# Altium schematic sheet projet_pcb_naked_g431.SchDoc
size A3 portrait
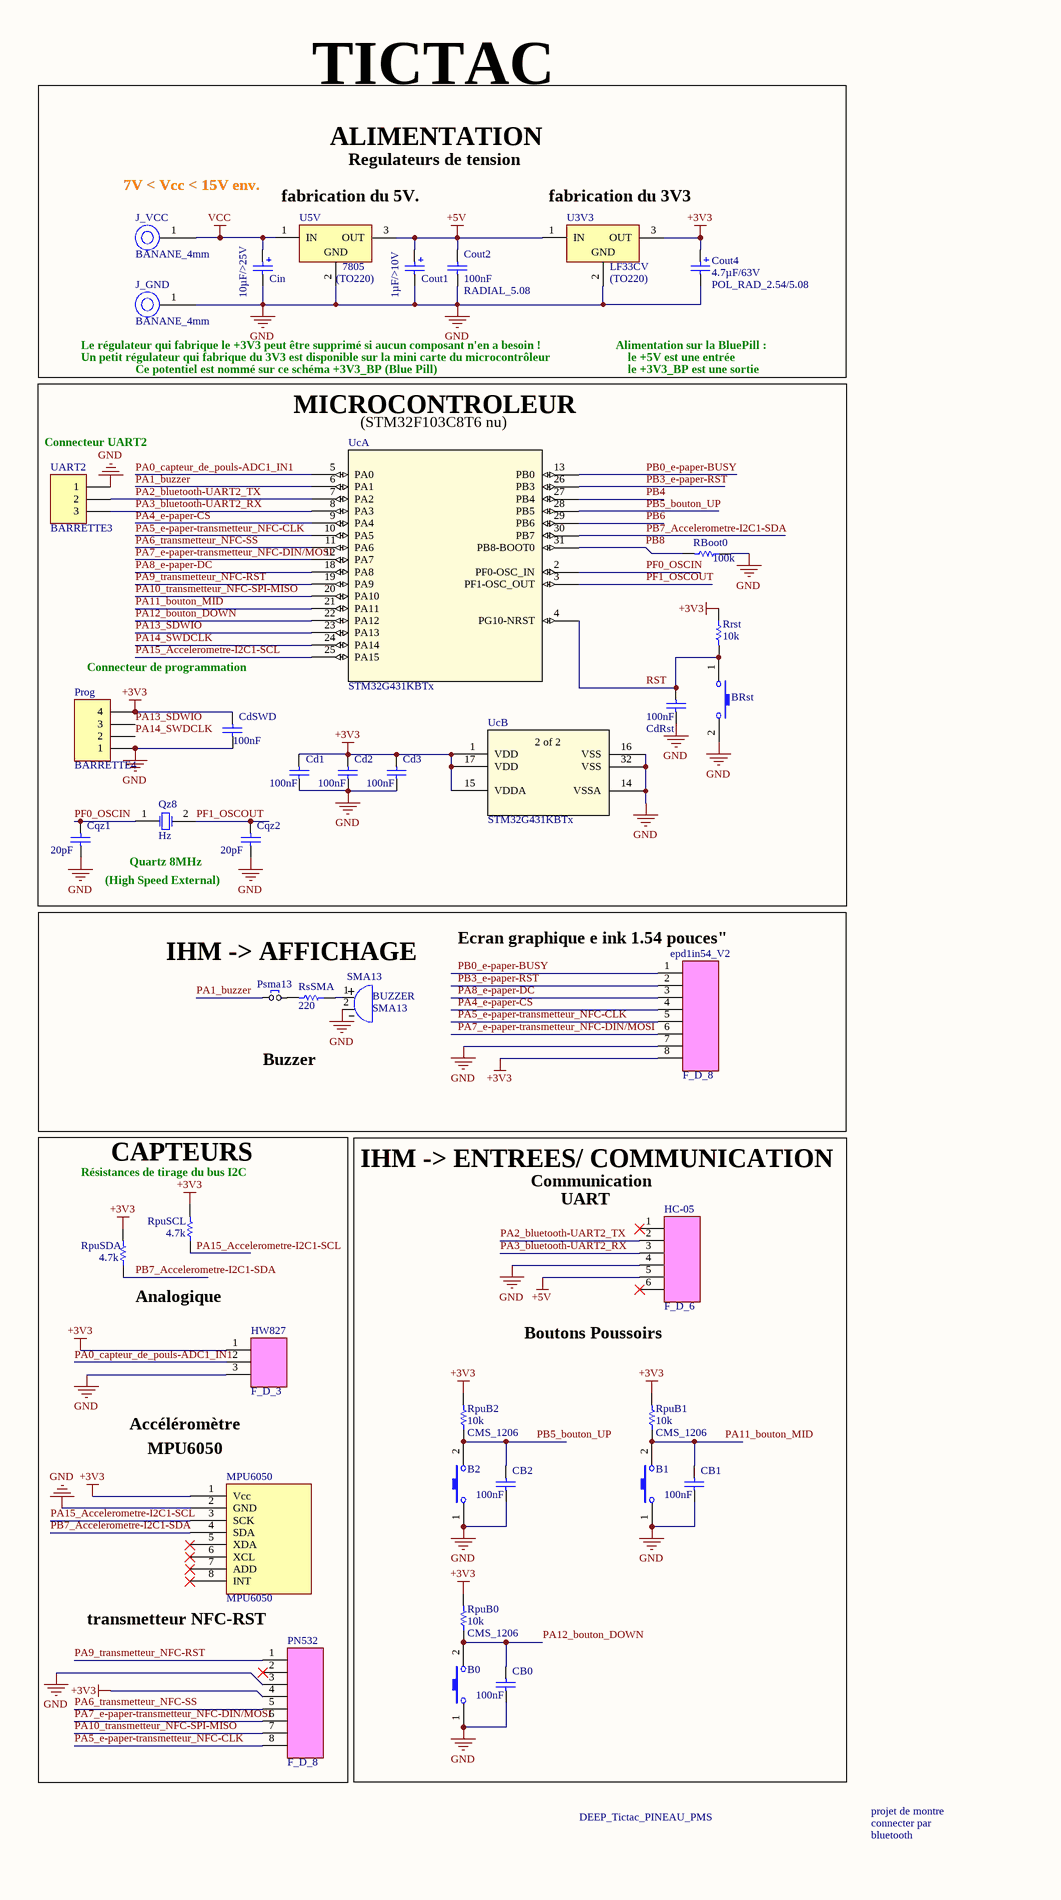
[diagram p0: projet_pcb_naked_g431.SchDoc, left]
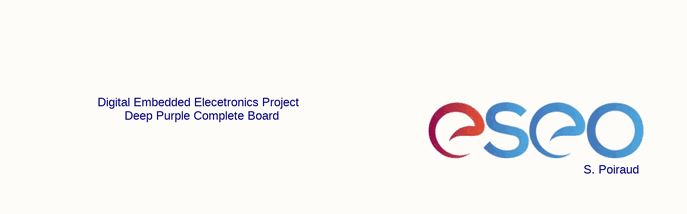
[diagram p1: projet_pcb_naked_g431.SchDoc, right]

## Parts
B0  BOUTON_POUSSOIR_MINIATURE_TRAVERSANT  [BOUTON_POUSSE_PLAT_6x6]  (value not drawn)
B1  BOUTON_POUSSOIR_MINIATURE_TRAVERSANT  [BOUTON_POUSSE_PLAT_6x6]  (value not drawn)
B2  BOUTON_POUSSOIR_MINIATURE_TRAVERSANT  [BOUTON_POUSSE_PLAT_6x6]  (value not drawn)
BRst  BOUTON_POUSSOIR_MINIATURE_TRAVERSANT  [BOUTON_POUSSE_PLAT_6x6]  (value not drawn)
CB0  value 100nF  [C0805_N]  (hidden comment: Condensateur 0805)
CB1  value 100nF  [C0805_N]  (hidden comment: Condensateur 0805)
CB2  value 100nF  [C0805_N]  (hidden comment: Condensateur 0805)
Cd1  value 100nF  [C0805_N]  (hidden comment: Condensateur 0805)
Cd2  value 100nF  [C0805_N]  (hidden comment: Condensateur 0805)
Cd3  value 100nF  [C0805_N]  (hidden comment: Condensateur 0805)
CdRst  value 100nF  [C0805_N]  (hidden comment: Condensateur 0805)
CdSWD  value 100nF  [C0805_N]  (hidden comment: Condensateur 0805)
Cin  value 10µF/>25V  [CONDENSATEUR_POLARISE_ELECTROLYTIQUE_RADIAL_2.0/5.08]  (hidden comment: CONDENSATEUR_POL_ELECTROLY_RAD_2.0/5.08)
Cout1  value 1µF/>10V  [CONDENSATEUR_POLARISE_ELECTROLYTIQUE_RADIAL_2.0/5.08]  (hidden comment: CONDENSATEUR_POL_ELECTROLY_RAD_2.0/5.08)
Cout2  value 100nF  Type: RADIAL_5.08  [CONDENSATEUR_CERAMIQUE_RADIAL_5.08]  (hidden comment: CONDENSATEUR_CER_RAD_5.08)
Cout4  value 4.7µF/63V  Type: POL_RAD_2.54/5.08  [CONDENSATEUR_POLARISE_ELECTROLYTIQUE_RADIAL_2.54/5.08]  (hidden comment: CONDENSATEUR_POL_ELECTROLY_RAD_2.54/5.08)
Cqz1  value 20pF  [C0805_N]  (hidden comment: Condensateur 0805)
Cqz2  value 20pF  [C0805_N]  (hidden comment: Condensateur 0805)
epd1in54_V2  Type: F_D_8  [BARRETTE_8_F_D]  (hidden comment: BARRETTE_8 CONTACTS_1 RANGEE_FEMELLE_DROITE)
HC-05  Type: F_D_6  [BARRETTE_6_F_D]  (hidden comment: BARRETTE_6 CONTACTS_1 RANGEE_FEMELLE_DROITE)
HW827  Type: F_D_3  [BARRETTE_3_F_D]  (hidden comment: BARRETTE 3 CONTACTS 1 RANGEE FEMELLE DROITE)
J_GND  Type: BANANE_4mm  [DOUILLE_BANANE_4mm]  (hidden comment: DOUILLE BANANE 4mm)
J_VCC  Type: BANANE_4mm  [DOUILLE_BANANE_4mm]  (hidden comment: DOUILLE BANANE 4mm)
MPU6050  MPU6050  [MPU6050]
PN532  Type: F_D_8  [BARRETTE_8_F_D]  (hidden comment: BARRETTE_8 CONTACTS_1 RANGEE_FEMELLE_DROITE)
Prog  BARRETTE4  [HE14_4]
Psma13  Jumper SIP 2.54  [HDR1X2]  (value not drawn)
Qz8  Hz  [HC49/4H_SMX]
RBoot0  100k  [R1206_N]
RpuB0  value 10k  Type: CMS_1206  [RESISTANCE_CMS_1206]  (hidden comment: RESISTANCE_CMS_1206)
RpuB1  value 10k  Type: CMS_1206  [RESISTANCE_CMS_1206]  (hidden comment: RESISTANCE_CMS_1206)
RpuB2  value 10k  Type: CMS_1206  [RESISTANCE_CMS_1206]  (hidden comment: RESISTANCE_CMS_1206)
RpuSCL  4.7k  [R1206_N]
RpuSDA  4.7k  [R1206_N]
Rrst  10k  [R1206_N]
RsSMA  220  [R1206_N]
SMA13  value SMA13  Type: BUZZER  [BUZZER_SMA13]  (hidden comment: BUZZER_SMA13)
U3V3  Type: LF33CV  Package: (TO220)  [REGULATEUR_TO220_78XX]  (hidden comment: REGULATEUR_TO220_78XX)
U5V  Type: 7805  Package: (TO220)  [REGULATEUR_TO220_78XX]  (hidden comment: REGULATEUR_TO220_78XX)
UART2  BARRETTE3  [HDR1X3]
Uc  STM32G431KBTx  [LQFP-32]  (parts A,B of 2)

## Blocks framed on the sheet
MICROCONTROLEUR: BRst Cd1-Cd3 CdRst CdSWD Cqz1 Cqz2 Prog Qz8 RBoot0 Rrst UART2 Uc
IHM -> AFFICHAGE: epd1in54_V2 Psma13 RsSMA SMA13
CAPTEURS: HW827 MPU6050 PN532 RpuSCL RpuSDA
IHM -> ENTREES/ COMMUNICATION: B0-B2 CB0-CB2 HC-05 RpuB0-RpuB2

## Nets
+3V3: Cd1.2 Cd2.2 Cd3.2 CdSWD.2 Cout4.1 epd1in54_V2.8 HW827.1 MPU6050.1(Vcc) PN532.4 Prog.4 RpuB0.2 RpuB1.2 RpuB2.2 RpuSCL.2 RpuSDA.2 Rrst.1 U3V3.3(OUT) Uc.1(VDD) Uc.15(VDDA) Uc.17(VDD)
+5V: Cout1.1 Cout2.2 HC-05.5 U3V3.1(IN) U5V.3(OUT)
GND: B0.1 B1.1 B2.1 BRst.2 CB0.1 CB1.1 CB2.1 Cd1.1 Cd2.1 Cd3.1 CdRst.1 CdSWD.1 Cin.2 Cout1.2 Cout2.1 Cout4.2 Cqz1.1 Cqz2.1 epd1in54_V2.7 HC-05.4 HW827.3 J_GND.1 MPU6050.2(GND) PN532.3 Prog.1 RBoot0.1 SMA13.2 U3V3.2(GND) U5V.2(GND) UART2.1 Uc.14(VSSA) Uc.16(VSS) Uc.32(VSS)
VCC: Cin.1 J_VCC.1 U5V.1(IN)
PA0_capteur_de_pouls-ADC1_IN1: HW827.2 Uc.5(PA0)
PA1_buzzer: Psma13.1 Uc.6(PA1)
PA2_bluetooth-UART2_TX: HC-05.2 UART2.2 Uc.7(PA2)
PA3_bluetooth-UART2_RX: HC-05.3 UART2.3 Uc.8(PA3)
PA4_e-paper-CS: epd1in54_V2.4 Uc.9(PA4)
PA5_e-paper-transmetteur_NFC-CLK: epd1in54_V2.5 PN532.8 Uc.10(PA5)
PA6_transmetteur_NFC-SS: PN532.5 Uc.11(PA6)
PA7_e-paper-transmetteur_NFC-DIN/MOSI: epd1in54_V2.6 PN532.6 Uc.12(PA7)
PA8_e-paper-DC: epd1in54_V2.3 Uc.18(PA8)
PA9_transmetteur_NFC-RST: PN532.1 Uc.19(PA9)
PA10_transmetteur_NFC-SPI-MISO: PN532.7 Uc.20(PA10)
PA11_bouton_MID: B1.2 CB1.2 RpuB1.1 Uc.21(PA11)
PA12_bouton_DOWN: B0.2 CB0.2 RpuB0.1 Uc.22(PA12)
PA13_SDWIO: Prog.3 Uc.23(PA13)
PA14_SWDCLK: Prog.2 Uc.24(PA14)
PA15_Accelerometre-I2C1-SCL: MPU6050.3(SCK) RpuSCL.1 Uc.25(PA15)
PB0_e-paper-BUSY: epd1in54_V2.1 Uc.13(PB0)
PB3_e-paper-RST: epd1in54_V2.2 Uc.26(PB3)
PB4: Uc.27(PB4)
PB5_bouton_UP: B2.2 CB2.2 RpuB2.1 Uc.28(PB5)
PB6: Uc.29(PB6)
PB7_Accelerometre-I2C1-SDA: MPU6050.4(SDA) RpuSDA.1 Uc.30(PB7)
PB8: RBoot0.2 Uc.31(PB8-BOOT0)
PF0_OSCIN: Cqz1.2 Qz8.1(OSC1) Uc.2(PF0-OSC_IN)
PF1_OSCOUT: Cqz2.2 Qz8.2(OSC2) Uc.3(PF1-OSC_OUT)
RST: BRst.1 CdRst.2 Rrst.2 Uc.4(PG10-NRST)
NetPsma13_2: Psma13.2 RsSMA.2
NetRsSMA_1: RsSMA.1 SMA13.1

Not connected (* = marked no-connect by the designer): HC-05 1* 6*; MPU6050 5(XDA)* 6(XCL)* 7(ADD)* 8(INT)*; PN532 2*

## Notes on the sheet
- TICTAC
- ALIMENTATION
- 7V < Vcc < 15V env.
- (near U5V) fabrication du 5V.
- Regulateurs de tension
- (near U3V3) fabrication du 3V3
- (near J_GND) Le régulateur qui fabrique le +3V3 peut être supprimé si aucun composant n'en a besoin !
- Alimentation sur la BluePill :
- (near J_GND) Un petit régulateur qui fabrique du 3V3 est disponible sur la mini carte du microcontrôleur
- Ce potentiel est nommé sur ce schéma +3V3_BP (Blue Pill)
- le +3V3_BP est une sortie
- le +5V est une entrée
- (near UART2) Connecteur UART2
- (near Uc) (STM32F103C8T6 nu)
- Connecteur de programmation
- (High Speed External)
- Quartz 8MHz
- (near epd1in54_V2) Ecran graphique e ink 1.54 pouces"
- Buzzer
- (near RpuSCL) Résistances de tirage du bus I2C
- (near HC-05) Communication
- UART
- (near RpuSDA) Analogique
- (near HC-05) Boutons Poussoirs
- Accéléromètre
- (near MPU6050) MPU6050
- transmetteur NFC-RST
- Digital Embedded Elecetronics Project
- DEEP_Tictac_PINEAU_PMS
- projet de montre
- connecter par
- bluetooth
- Deep Purple Complete Board
- S. Poiraud
- Title
- Size:
- Date:
- A3
- Number:
- Time:
- Revision:
- Sheet
- of
- File:
- (in symbol STM32G431KBTx, part B) 2 of 2

## Library data of the parts
B0-B2 BRst = BOUTON_POUSSOIR_MINIATURE_TRAVERSANT: BOUTON POUSSOIR MINIATURE TRAVERSANT ON/OFF; Type: B_POUSS_MINI_T
CB0-CB2 Cd1-Cd3 CdRst CdSWD Cqz1 Cqz2 = CONDENSATEUR_CER_RAD_5.08: Type: RADIAL_5.08
Cin Cout1 = CONDENSATEUR_POL_ELECTROLY_RAD_2.0/5.08: CONDENSATEUR POLARISE ELECTROLYTIQUE RADIAL 2.0/5.08; Type: POL_RAD_2.0/5.08
Cout2 = CONDENSATEUR_CER_RAD_5.08: CONDENSATEUR TRAVERSANT CERAMIQUE RADIAL 5.08mm
Cout4 = CONDENSATEUR_POL_ELECTROLY_RAD_2.54/5.08: CONDENSATEUR POLARISE ELECTROLYTIQUE RADIAL 2.54/5.08
HC-05 = BARRETTE_6 CONTACTS_1 RANGEE_FEMELLE_DROITE: BARRETTE 6 CONTACTS 1 RANGEE FEMELLE DROITE
HW827 = BARRETTE_3 CONTACTS_1 RANGEE_FEMELLE_DROITE
J_GND J_VCC = DOUILLE_BANANE_4mm: DOUILLE BANANE 4 mm
Prog = BARRETTE4: Header, 4-Pin; LatestRevisionDate: 17-Jul-2002; LatestRevisionNote: Re-released for DXP Platform.; Publisher: Altium Limited
Psma13 = Jumper SIP2.54
Qz8 = Quartz: Crystal Oscillator; Published: 8-Jun-2000; LatestRevisionDate: 17-Jul-2002; LatestRevisionNote: Re-released for DXP Platform.; PackageReference: R38; Publisher: Altium Limited
RBoot0 RpuSCL RpuSDA Rrst RsSMA = Resistor: Published: 8-Jun-2000; LatestRevisionDate: 17-Jul-2002; LatestRevisionNote: Re-released for DXP Platform.; PackageReference: AXIAL-0.5; Publisher: Altium Limited
RpuB0-RpuB2 = RESISTANCE_CMS_1206: RESISTANCE CMS 1206
SMA13 = BUZZER_SMA13: BUZZER SMA13
U3V3 U5V = REGULATEUR_TO220_78XX: REGULATEUR DE TENSION POSITIVE 78XX BOITIER TO220
UART2 = BARRETTE3: Header, 3-Pin; LatestRevisionDate: 17-Jul-2002; LatestRevisionNote: Re-released for DXP Platform.; Publisher: Altium Limited
Uc = STM32G431KBTx: Mainstream Arm Cortex-M4 core with DSP and FPU, 170MHz with 128Kbytes of Flash memory, Math Accelerator, Medium Analog level integration; Manufacturer_Part_Number: stm32g4_lqfp32_t1; Built_By: EMA_Jessica; Vendor: STMicroelectronics; Copyright: Copyright (C) 2016 Accelerated Designs. All rights reserved; RefDes: RefDes; Type: DEV; Value: Value